# EAGLE design wiPOWER (EAGLE 9.6.1)
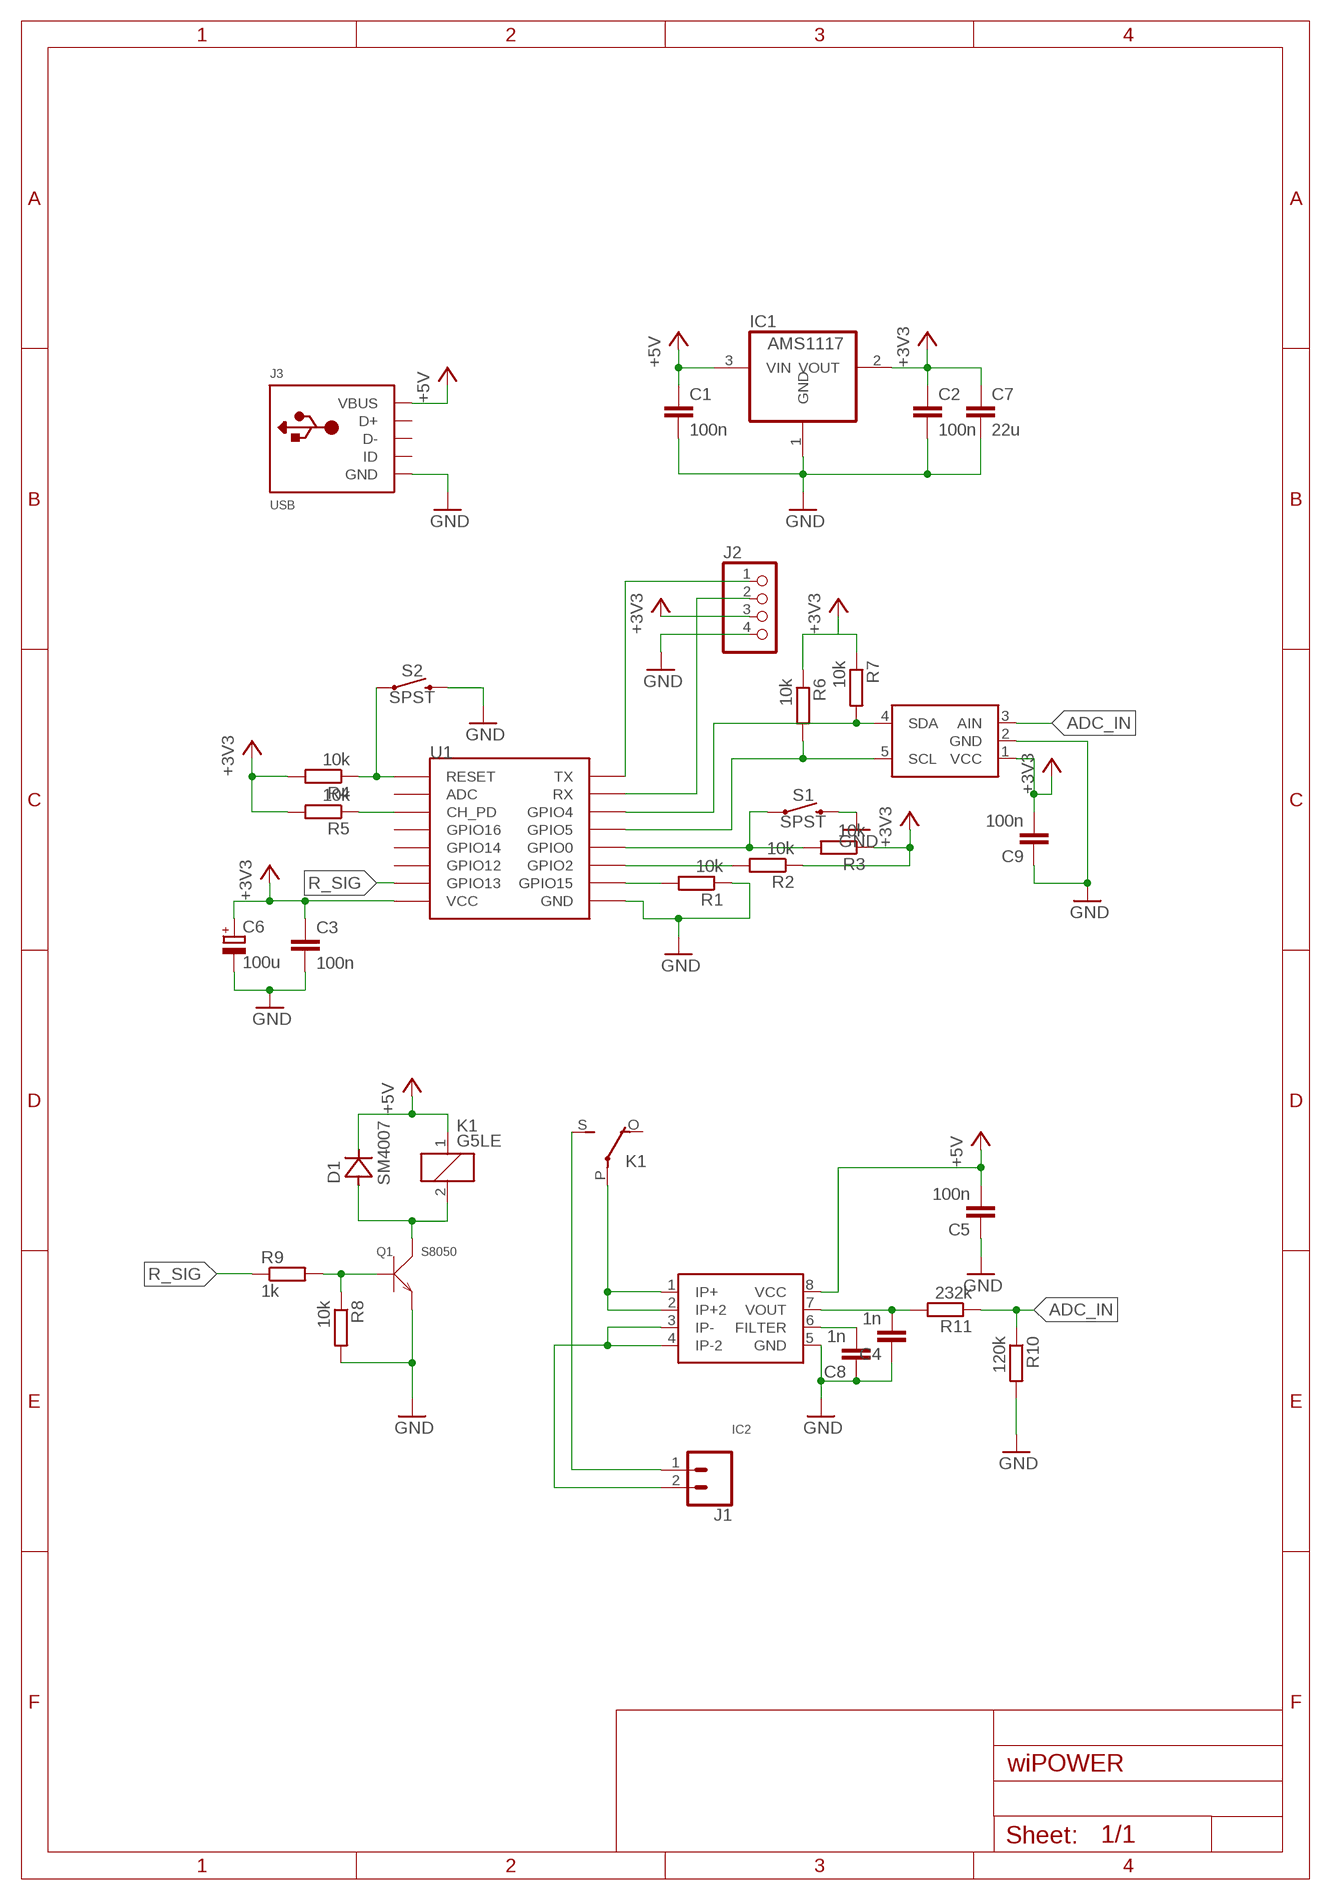
[diagram p0: schematic, sheet 1]

## Parts
C1  100n  C-EUC0603  [C0603]
C2  100n  C-EUC0603  [C0603]
C3  100n  C-EUC0603  [C0603]
C4  1n  C-EUC0603  [C0603]
C5  100n  C-EUC0603  [C0603]
C6  100u  CPOL-EUB/3528-21R  [B/3528-21R]
C7  22u  C-EUC0603  [C0603]
C8  1n  C-EUC0603  [C0603]
C9  100n  C-EUC0603  [C0603]
D1  SM4007  SM4007PL  [DIODE_SOD123]
IC1  AMS1117  REG1117  [SOT223]
IC2  ACS724  [SOIC8]
J1  CONN_025MM  [SCREWTERMINAL-5MM-2]
J2  PINHD-1X4  [1X04]
J3  USB  USB-MICRO  [MIC-USB]
K1  G5LE  [G5LE]
Q1  S8050  SMD-TRANSISTORS-NPN-25V-500MW-S8050(SOT-23)  [SOT-23]
R1  10k  R-EU_R0603  [R0603]
R2  10k  R-EU_R0603  [R0603]
R3  10k  R-EU_R0603  [R0603]
R4  10k  R-EU_R0603  [R0603]
R5  10k  R-EU_R0603  [R0603]
R6  10k  R-EU_R0603  [R0603]
R7  10k  R-EU_R0603  [R0603]
R8  10k  R-EU_R0603  [R0603]
R9  1k  R-EU_R0603  [R0603]
R10  120k  R-EU_R0603  [R0603]
R11  232k  R-EU_R0603  [R0603]
S1  SPST  MOMENTARY-SWITCH-SPST-SMD-6.0X3.5MM  [TACTILE_SWITCH_SMD_6.0X3.5MM]
S2  SPST  MOMENTARY-SWITCH-SPST-SMD-6.0X3.5MM  [TACTILE_SWITCH_SMD_6.0X3.5MM]
U1  ESP12SMD  [ESP12-SMD]
U$1  MCP3221SOT23-5  [GHI-IC_SOT23-5(MICROCHIP)]

## Nets
+3V3 [power]: C2.1 C3.1 C6.+ C7.1 C9.2 IC1.2(VOUT) J2.3 R2.1 R3.1 R4.2 R5.2 R6.1 R7.1 U1.VCC U$1.1(VCC)
+5V: C1.1 C5.2 D1.C IC1.3(VIN) IC2.8(VCC) J3.P$5(VBUS) K1.1
ADC_IN [sig]: R10.1 R11.1 U$1.3(AIN)
GND [power]: C1.2 C2.2 C3.2 C4.1 C5.1 C6.- C7.2 C8.1 C9.1 IC1.1(GND) IC2.5(GND) J2.4 J3.P$2(GND) Q1.2(E) R1.1 R8.2 R10.2 S1.2 S2.2 U1.GND U$1.2(GND)
IP+ [high]: IC2.1(IP+) IC2.2(IP+2) K1.P(2:P)
IP- [high]: IC2.3(IP-) IC2.4(IP-2) J1.2
N$1: J2.1 U1.TXD0(TX)
N$2: J2.2 U1.RXD0(RX)
N$3: C8.2 IC2.6(FILTER)
N$4: R4.1 S2.1 U1.RESET
N$5 [sig]: C4.2 IC2.7(VOUT) R11.2
N$6: R6.2 U1.GPIO5 U$1.5(SCL)
N$7: R5.1 U1.CH_PD
N$8: R7.2 U1.GPIO4 U$1.4(SDA)
N$10: R1.2 U1.GPIO15
N$11: R2.2 U1.GPIO2
N$12: R3.2 S1.1 U1.GPIO0
N$14: D1.A K1.2 Q1.3(C)
N$15: Q1.1(B) R8.1 R9.2
PRE_IP+ [high]: J1.1 K1.S(2:S)
R_SIG: R9.1 U1.GPIO13
Unconnected: J3.P$1(ID) J3.P$3(D+) J3.P$4(D-) K1.O(2:O) U1.ADC U1.GPIO12 U1.GPIO14 U1.GPIO16

## Library data of the parts
C1-C5 C7-C9 = rcl:C-EU: CAPACITOR, European symbol; SPICEPREFIX: C
C6 = rcl:CPOL-EU: POLARIZED CAPACITOR, European symbol; SPICEPREFIX: C
D1 = mylib:SM4007PL
IC1 = burr-brown:REG1117: 800mA and 1A Low Dropout (LDO) Positive Regulator 1.8V, 2.5V, 2.85V, 3.3V, 5V, and Adj; MPN: REG1117; OC_FARNELL: 1097566; OC_NEWARK: 14P6981
IC2 = mylib:ACS724
J1 = SparkFun-Connectors:CONN_02: Multi connection point. Often used as Generic Header-pin footprint for 0.1 inch spaced/style header connections On any of the 0.1 inch spaced packages, you can populate with these: Break Away Headers - Straight <https://www.sparkfun.com/products/116> (PRT-00116) Break Away Male Headers - Right Angle <https://www.sparkfun.com/products/553> (PRT-00553) Female Headers <https://www.sparkfun.com/products/115> (PRT-00115) Break Away Headers - Machine Pin <https://www.sparkfun.com/products/117> (PRT-00117) Break Away Female Headers - Swiss Machine Pin <https://www.sparkfun.com/products/743> (PRT-00743) For SCREWTERMINALS and SPRING TERMINALS visit here: Screw Terimnals on SparkFun.com <https://www.sparkfun.com/search/results?term=Screw+Terminals> (5mm/3.5mm/2.54mm spacing) This device is also useful as a general connection point to wire up your design to another part of your project. Our various solder wires solder well into these plated through hole pads. Hook-Up Wire - Assortment (Stranded, 22 AWG) <https://www.sparkfun.com/products/11375> (PRT-11375) Hook-Up Wire - Assortment (Solid Core, 22 AWG) <https://www.sparkfun.com/products/11367> (PRT-11367) View the entire wire category on our website here <https://www.sparkfun.com/categories/141> Special notes: Molex polarized connector foot print use with: PRT-08233 with associated crimp pins and housings. 2.54_SCREWTERM for use with PRT-10571. 3.5mm Screw Terminal footprints for PRT-08084 5mm Screw Terminal footprints for use with PRT-08432; SF_SKU: PRT-08432
J2 = pinhead:PINHD-1X4: PIN HEADER
J3 = mylib:USB-MICRO
K1 = relay:G5LE: RELAY 1 x switch, 10 A/120 V AC, 8 A/30 V DC, Omron; OC_FARNELL: unknown; OC_NEWARK: unknown
Q1 = OPL_Discrete_Semiconductor:SMD-TRANSISTORS-NPN-25V-500MW-S8050(SOT-23): 305010017; MPN: S8050
R1-R11 = rcl:R-EU_: RESISTOR, European symbol; SPICEPREFIX: R
S1 S2 = SparkFun-Switches:MOMENTARY-SWITCH-SPST: Momentary Switch (Pushbutton) - SPST Normally-open (NO) SPST momentary switches (buttons, pushbuttons). Variants PTH-12MM - 12mm square, through-hole Momentary Pushbutton Switch - 12mm Square <https://www.sparkfun.com/products/9190> (COM-09190) PTH-6.0MM, PTH-6.0MM-KIT - 6.0mm square, through-hole Mini Pushbutton Switch <https://www.sparkfun.com/products/97> (COM-00097) KIT package intended for soldering kit's - only one side of pads' copper is exposed. PTH-RIGHT-ANGLE-KIT - Right-angle, through-hole Right Angle Tactile Button <https://www.sparkfun.com/products/10791> - Used on SparkFun BigTime Watch Kit <https://www.sparkfun.com/products/11734> SMD-12MM - 12mm square, surface-mount Tactile Button - SMD (12mm) <https://www.sparkfun.com/products/12993> (COM-12993) Used on SparkFun PicoBoard <https://www.sparkfun.com/products/11888> SMD-4.5MM - 4.5mm Square Trackball Switch Used on SparkFun Blackberry Trackballer Breakout <https://www.sparkfun.com/products/13169> SMD-4.6MMX2.8MM - 4.60mm x 2.80mm, surface mount Used on SparkFun SAMD21 Mini Breakout <https://www.sparkfun.com/products/13664> SMD-5.2MM, SMD-5.2-REDUNDANT - 5.2mm square, surface-mount Mini Pushbutton Switch - SMD <https://www.sparkfun.com/products/8720> (COM-08720) Used on Arduino Pro Mini <https://www.sparkfun.com/products/11114> REDUNDANT package connects both switch circuits together SMD-6.0X3.5MM - 6.0 x 3.5mm, surface mount Momentary Reset Switch SMD <https://www.sparkfun.com/products/8229> (COM-08229) SMD-6.2MM-TALL - 6.2mm square, surface mount Tactile Button - SMD (6mm) <https://www.sparkfun.com/products/12992> Used on SparkFun Digital Sandbox <https://www.sparkfun.com/products/12651> SMD-RIGHT-ANGLE - Right-angle, surface mount Used on SparkFun Block for Intel® Edison - Arduino <https://www.sparkfun.com/products/13036>; PROD_ID: SWCH-00815; SF_SKU: COM-08229
U1 = esp8266modules:ESP12: ESP8266 Wifi module 12
U$1 = mylib:MCP3221

## Net classes
0 default: width 0.203 mm
1 power: width 0.305 mm
2 high: width 25.4 mm, clearance 0.762 mm
3 sig: width 0.254 mm, clearance 0.508 mm

## Board
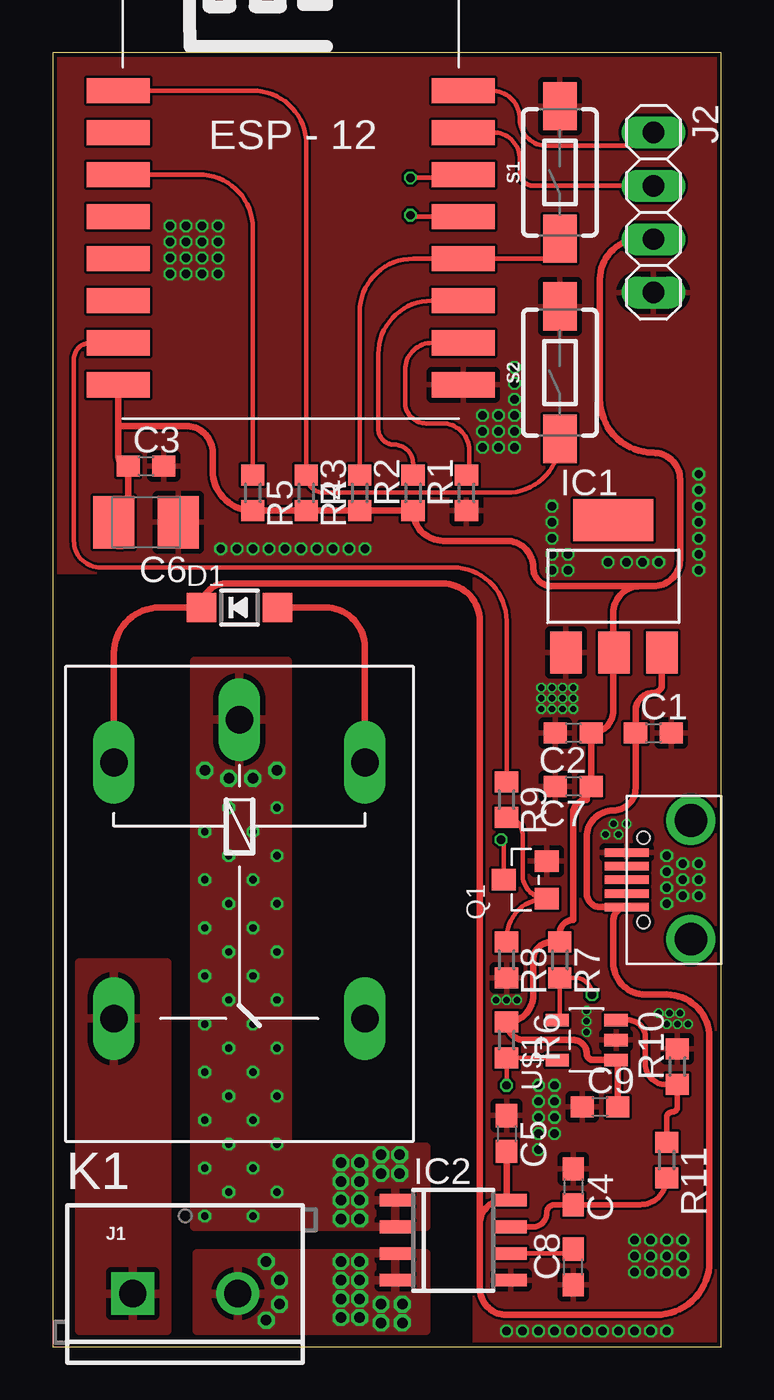
[diagram p1: board, top side]
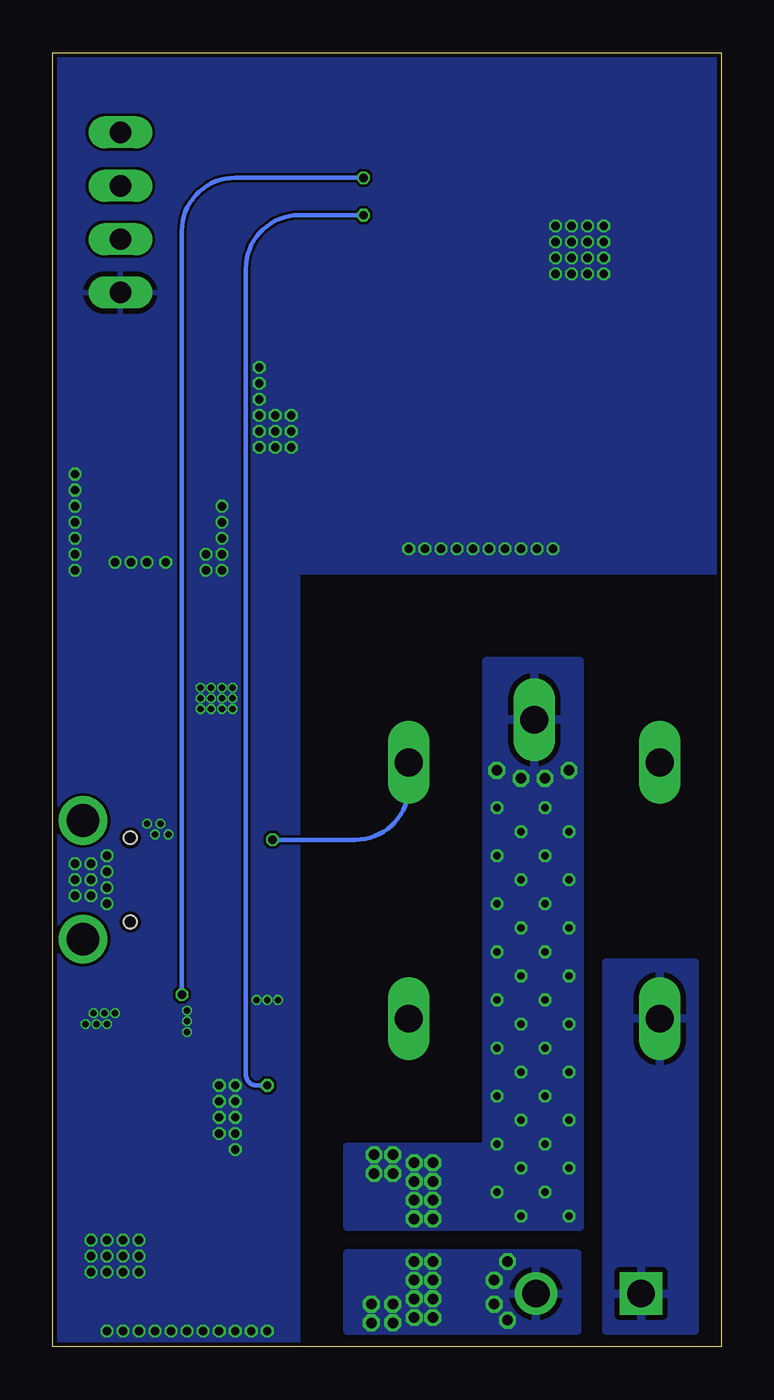
[diagram p2: board, bottom side, seen from below]

Size 31.8 x 61.59 mm. Coordinates in mm from the lower left corner, seen from the top.
Outline: 0,0 31.8,0 31.8,61.59 0,61.59 0,0
Copper layers (1*16): Top 0.035559375mm / dielectric 1.6mm / Bottom 0.035559375mm
Design rules "jlcpcb2layer": minimum track width 5mil, minimum drill 12mil, track to track 5mil, track to pad 5mil, pad to pad 5mil, via to via 5mil, smd to smd 5mil, copper to edge 8mil, drill to drill 6mil, minimum pad ring 5mil, minimum via ring 3mil, stop-mask expansion 2.5mil, vias tented up to drill 0mil, thermal gap 10mil

### Footprints (pad centres in the part's own frame; a part is rotated, then mirrored left to right if it is on the bottom)
C0603 = smd 1.1 x 1: 1 -0.85,0; 2 0.85,0
B/3528-21R = smd 1.95 x 2.5: + 1.525,0; - -1.525,0
DIODE_SOD123 = smd 1.4 x 1.4: A 1.805,0; C -1.805,0
SOT223 = smd 1.499 x 2.007: 1 -2.261,-3.15; 2 0.025,-3.15; 3 2.311,-3.15 | smd 3.81 x 2.007: 4 0,3.15
SOIC8 = smd 0.6 x 1.5: 1 -1.905,-2.75; 2 -0.635,-2.75; 3 0.635,-2.75; 4 1.905,-2.75; 5 1.905,2.75; 6 0.635,2.75; 7 -0.635,2.75; 8 -1.905,2.75
SCREWTERMINAL-5MM-2 = drill 1.3 pad 2.032 square: 1 0,0 | drill 1.3 pad 2.032: 2 5,0
1X04 = drill 1.016 long: 1 -3.81,0; 2 -1.27,0; 3 1.27,0; 4 3.81,0
MIC-USB = smd 0.4 x 2.1: P$1 -0.65,0; P$2 -1.3,0; P$3 0,0; P$4 0.65,0; P$5 1.3,0 | drill 1.55: P$6 -2.825,3.05; P$7 2.825,3.05 | hole 0.6: -2,0.8; 2,0.8
G5LE = drill 1.321 long: 1 -7.493,-5.969; 2 -7.493,5.969; O 4.699,5.969; P -9.525,0; S 4.699,-5.969
SOT-23 = smd 1.016 x 1.143: 1 -0.889,-1.016; 2 0.889,-1.016; 3 0,1.016
R0603 = smd 1 x 1.1: 1 -0.85,0; 2 0.85,0
TACTILE_SWITCH_SMD_6.0X3.5MM = smd 2.3 x 1.6: 1 -3.15,0; 2 3.15,0
ESP12-SMD = smd 3 x 1.2: ADC -8.3,3.8; CH_PD -8.3,1.8; GND 8.1,-8.2; GPIO0 8.1,-2.2; GPIO2 8.1,-4.2; GPIO4 8.1,1.8; GPIO5 8.1,-0.2; GPIO12 -8.3,-4.2; GPIO13 -8.3,-6.2; GPIO14 -8.3,-2.2; GPIO15 8.1,-6.2; GPIO16 -8.3,-0.2; RESET -8.3,5.8; RXD0 8.1,3.8; TXD0 8.1,5.8; VCC -8.3,-8.2
GHI-IC_SOT23-5(MICROCHIP) = smd 0.6 x 1.1: 1 -0.95,-1.4; 2 0,-1.4; 3 0.95,-1.4; 4 0.95,1.4; 5 -0.95,1.4

### Placement (x,y rotation side)
C1  28.57,29.21 0 top
C2  24.77,29.21 180 top
C3  4.45,41.91 0 top
C4  24.77,7.62 270 top
C5  21.59,10.16 270 top
C6  4.45,39.24 180 top
C7  24.77,26.67 180 top
C8  24.77,3.81 90 top
C9  26.04,11.43 0 top
D1  8.89,35.18 0 top
IC1  26.67,36.2 0 top
IC2  19.05,5.08 270 top
J1  3.81,2.54 0 top
J2  28.57,53.98 270 top
J3  27.3,22.23 270 top
K1  8.89,20.32 270 top
Q1  22.48,22.23 90 top
R1  19.68,40.64 90 top
R2  17.14,40.64 90 top
R3  14.61,40.64 90 top
R4  12.06,40.64 270 top
R5  9.53,40.64 270 top
R6  21.59,14.61 270 top
R7  24.13,18.41 270 top
R8  21.59,18.41 270 top
R9  21.59,26.04 270 top
R10  29.72,13.34 90 top
R11  29.21,8.89 270 top
S1  24.13,55.88 90 top
S2  24.13,46.35 90 top
U1  11.43,53.98 0 top
U$1  25.4,14.61 90 top

### Tracks (layer width: path | path; a pad name or v marks a point on that pad's centre or on a via)
+3V3
  Top 0.305: 26.67,33.02 arc-90 IC1.2 | J2.3 27.94,52.7 arc90 26.04,50.8 26.04,45.09 arc90 28.57,42.55 arc-90 29.84,41.27 29.84,37.47 arc-90 28.57,36.2 27.94,36.2 | 27.94,36.2 arc90 26.67,34.92 26.67,33.02 | U1.VCC 3.13,43.81 | 3.13,43.81 3.13,42.38 arc90 C3.1 3.6,38.52 arc-90 3.17,38.1 arc-90 2.92,38.35 C6.+ | 3.13,43.81 6.35,43.81 arc-90 7.62,42.55 7.62,41.7 arc90 R5.2 R4.2 R3.1 R2.1 arc90 18.58,38.35 21.59,38.35 arc-90 22.86,37.08 arc90 23.75,36.2 27.94,36.2 | C9.2 26.89,13.57 arc90 U$1.1 25.71,13.65 arc-90 25.4,13.97 arc90 24.77,14.61 22.44,14.61 arc-90 R6.1 arc90 22.86,16.73 22.86,18.41 arc-90 23.71,19.27 R7.1 24.13,19.68 arc-90 24.77,20.32 24.77,25.4 arc-90 25.4,26.04 25.4,26.45 arc-90 C7.1 C2.1 arc90 26.67,30.27 26.67,33.02
+5V
  Top 0.305: IC1.3 28.98,31.52 arc-90 28.57,31.11 arc90 27.73,30.27 C1.1 27.73,26.58 arc-90 26.67,25.53 arc90 25.4,24.26 25.4,21.59 arc90 26.07,20.93 J3.P$5 arc90 26.67,20.29 26.67,18.29 arc90 28.19,16.76 29.21,16.76 arc-90 31.24,14.73 31.24,4.06 arc-90 28.7,1.52 21.59,1.52 arc-90 20.32,2.79 20.32,5.84 | K1.1 2.92,33.02 arc-90 5.08,35.18 D1.C arc-90 8.23,36.32 18.54,36.32 arc-90 20.32,34.54 20.32,5.84 | IC2.8 arc-90 21.59,7.2 C5.2 | 21.67,7.11 arc-90 IC2.8 | IC2.8 21.46,6.99 arc90 20.32,5.84
ADC_IN
  Top 0.254: U$1.3 27.37,15.55 arc-90 28.19,14.73 28.19,13.46 arc90 29.17,12.48 R10.1 29.72,11.43 arc-90 29.46,11.18 arc90 29.21,10.92 R11.1
GND  (via drill 0.3, 0.4)
  other vias: 22.35,0.76 23.11,0.76 23.88,0.76 24.64,0.76 25.4,0.76 26.16,0.76 26.92,0.76 27.69,0.76 28.45,0.76 29.21,0.76 21.59,0.76 27.69,5.08 28.45,5.08 29.21,5.08 29.97,5.08 29.97,4.32 29.97,3.56 29.21,3.56 28.45,3.56 27.69,3.56 27.69,4.32 28.45,4.32 29.21,4.32 23.88,12.45 23.11,12.45 23.11,11.68 23.88,11.68 23.88,10.92 23.11,10.92 23.11,10.16 23.88,10.16 23.11,9.4 25.4,14.99 25.4,15.49 25.4,16 29.21,15.37 21.08,16.51 21.59,16.51 22.1,16.51 29.72,15.37 30.23,15.37 28.83,15.88 29.34,15.88 29.84,15.88 29.21,23.37 29.21,22.61 29.21,21.84 29.21,21.08 29.97,22.99 29.97,22.23 29.97,21.46 30.73,21.46 30.73,22.23 30.73,22.99 26.29,24.38 26.92,24.38 26.67,24.89 27.3,24.89 30.73,36.96 30.73,37.72 30.73,38.48 30.73,39.24 30.73,40.01 30.73,40.77 30.73,41.53 23.75,37.72 23.75,36.96 26.42,37.34 27.3,37.34 28.07,37.34 28.83,37.34 23.75,38.48 23.75,39.24 23.75,40.01 24.51,37.72 24.51,36.96 20.45,44.32 21.21,44.32 21.97,44.32 21.97,43.56 21.21,43.56 20.45,43.56 20.45,42.8 21.21,42.8 21.97,42.8 21.97,45.09 21.97,45.85 21.97,46.61 5.59,53.34 6.35,53.34 7.11,53.34 7.87,53.34 7.87,52.58 7.11,52.58 6.35,52.58 5.59,52.58 5.59,51.82 6.35,51.82 7.11,51.82 7.87,51.82 7.87,51.05 7.11,51.05 6.35,51.05 5.59,51.05 8,37.97 8.76,37.97 9.53,37.97 10.29,37.97 11.05,37.97 11.81,37.97 12.57,37.97 13.34,37.97 14.1,37.97 14.86,37.97 23.24,31.37 23.75,31.37 24.26,31.37 24.77,31.37 23.24,30.86 23.75,30.86 24.26,30.86 24.77,30.86 24.77,30.35 24.26,30.35 23.75,30.35 23.24,30.35
  pour Top: 0,61.47 31.75,61.47 31.75,0 20.07,0 20.07,36.83 0,36.83
  pour Bottom: 0,61.47 31.75,61.47 31.75,0 20.07,0 20.07,36.83 0,36.83
IP+  (via drill 0.35 pad 0.6, 0.5 pad 0.8)
  other vias: 13.72,6.1 14.61,6.1 14.61,6.99 13.72,6.99 13.72,7.87 13.72,8.76 14.61,8.76 14.61,7.87 15.62,8.26 15.62,9.14 16.51,9.14 16.51,8.26 7.24,6.22 8.38,7.37 9.53,6.22 10.67,7.37 7.24,8.51 9.53,8.51 8.38,9.65 10.67,9.65 9.53,10.79 7.24,10.79 8.38,11.94 10.67,11.94 7.24,13.08 9.53,13.08 8.38,14.22 10.67,14.22 7.24,15.37 8.38,16.51 9.53,15.37 10.67,16.51 7.24,17.65 9.53,17.65 8.38,18.8 10.67,18.8 9.53,19.94 7.24,19.94 8.38,21.08 10.67,21.08 7.24,22.23 9.53,22.23 8.38,23.37 10.67,23.37 7.24,24.51 9.53,24.51 10.67,25.65 8.38,25.65 7.24,27.43 8.38,27.05 9.53,27.05 10.67,27.43
  pour Top: 6.73,32.64 11.18,32.64 11.18,9.53 17.78,9.53 17.78,5.71 6.73,5.71
  pour Bottom: 6.73,32.64 11.18,32.64 11.18,9.53 17.78,9.53 17.78,5.71 6.73,5.71
IP-  (via drill 0.5 pad 0.8)
  other vias: 14.61,4.06 14.61,3.17 14.61,2.29 14.61,1.4 15.62,2.03 16.64,2.03 15.62,1.14 16.64,1.14 13.72,4.06 13.72,3.17 13.72,2.29 13.72,1.4 10.16,4.06 10.79,3.17 10.79,2.03 10.16,1.27
  pour Top: 6.86,0.76 6.86,4.45 17.78,4.45 17.78,0.76
  pour Bottom: 6.86,0.76 6.86,4.45 17.78,4.45 17.78,0.76
N$1
  Top 0.203: U1.TXD0 20.87,59.77 arc-90 22.23,58.42 arc90 23.5,57.15 27.94,57.15 arc90 J2.1
N$2
  Top 0.203: J2.2 22.86,55.24 arc-90 22.23,55.88 22.23,56.52 arc90 20.95,57.78 19.54,57.78 arc90 U1.RXD0
N$3
  Top 0.203: IC2.6 24.55,4.45 arc90 C8.2
N$4
  Top 0.203: U1.RESET 9.53,59.77 arc-90 12.06,57.23 R4.1 arc90 12.91,40.64 21.59,40.64 arc90 24.13,43.18 S2.1
N$5
  Top 0.254: IC2.7 22.86,5.71 arc90 23.5,6.35 arc-90 23.91,6.77 C4.2 27.94,6.77 arc90 R11.2
N$6  (via drill 0.4)
  Top 0.203: U$1.5 arc90 23.9,13.76 R6.2 v21.59,12.45 | U1.GPIO5 17.09,53.77 arc-90 v17.02,53.85
  Bottom 0.203: v21.59,12.45 22.1,12.45 arc90 22.61,12.95 22.61,51.31 arc90 20.07,53.85 v17.02,53.85
N$7
  Top 0.203: U1.CH_PD 6.99,55.77 arc-90 9.53,53.23 R5.1
N$8  (via drill 0.4)
  Top 0.203: U$1.4 arc90 24.13,15.69 R7.2 24.85,17.57 arc-90 v25.65,16.76 | v17.02,55.63 19.38,55.63 arc90 U1.GPIO4
  Bottom 0.203: v25.65,16.76 25.65,53.09 arc90 23.11,55.63 v17.02,55.63
N$10
  Top 0.203: 20.8,47.77 U1.GPIO15 18.06,47.77 arc90 16.76,46.48 16.76,44.96 arc90 17.78,43.94 18.54,43.94 arc-90 19.81,42.67 19.81,41.62 arc-90 R1.2
N$11
  Top 0.203: R2.2 17.14,42.04 arc90 16.26,42.93 arc-90 15.49,43.69 15.49,47.23 arc-90 18.03,49.77 U1.GPIO2
N$12
  Top 0.203: S1.1 arc-90 24.77,52.09 24.77,52.07 arc-90 24.47,51.77 19.68,51.77 U1.GPIO0 17.14,51.77 arc90 14.61,49.23 R3.2
N$14  (via drill 0.4)
  Top 0.203: Q1.3 21.46,24 arc90 v21.34,24.13
  Top 0.305: D1.A 12.95,35.18 arc-90 14.86,33.27 K1.2
  Bottom 0.203: v21.34,24.13 17.4,24.13 arc-90 14.86,26.67 K1.2
N$15
  Top 0.203: R8.1 21.59,19.43 arc-90 Q1.1 | 23.11,21.34 Q1.1 | R9.2 arc-90 22.35,24.42 22.35,22.48 arc90 Q1.1
PRE_IP+
  pour Top: 1.27,18.29 5.46,18.29 5.46,0.76 1.27,0.76
  pour Bottom: 1.27,18.29 5.46,18.29 5.46,0.76 1.27,0.76
R_SIG
  Top 0.203: U1.GPIO13 1.8,47.77 arc90 1.02,46.99 1.02,38.35 arc90 2.29,37.08 19.05,37.08 arc-90 21.59,34.54 R9.1